# Altium schematic sheet Kinen Expansion.SchDoc
size B
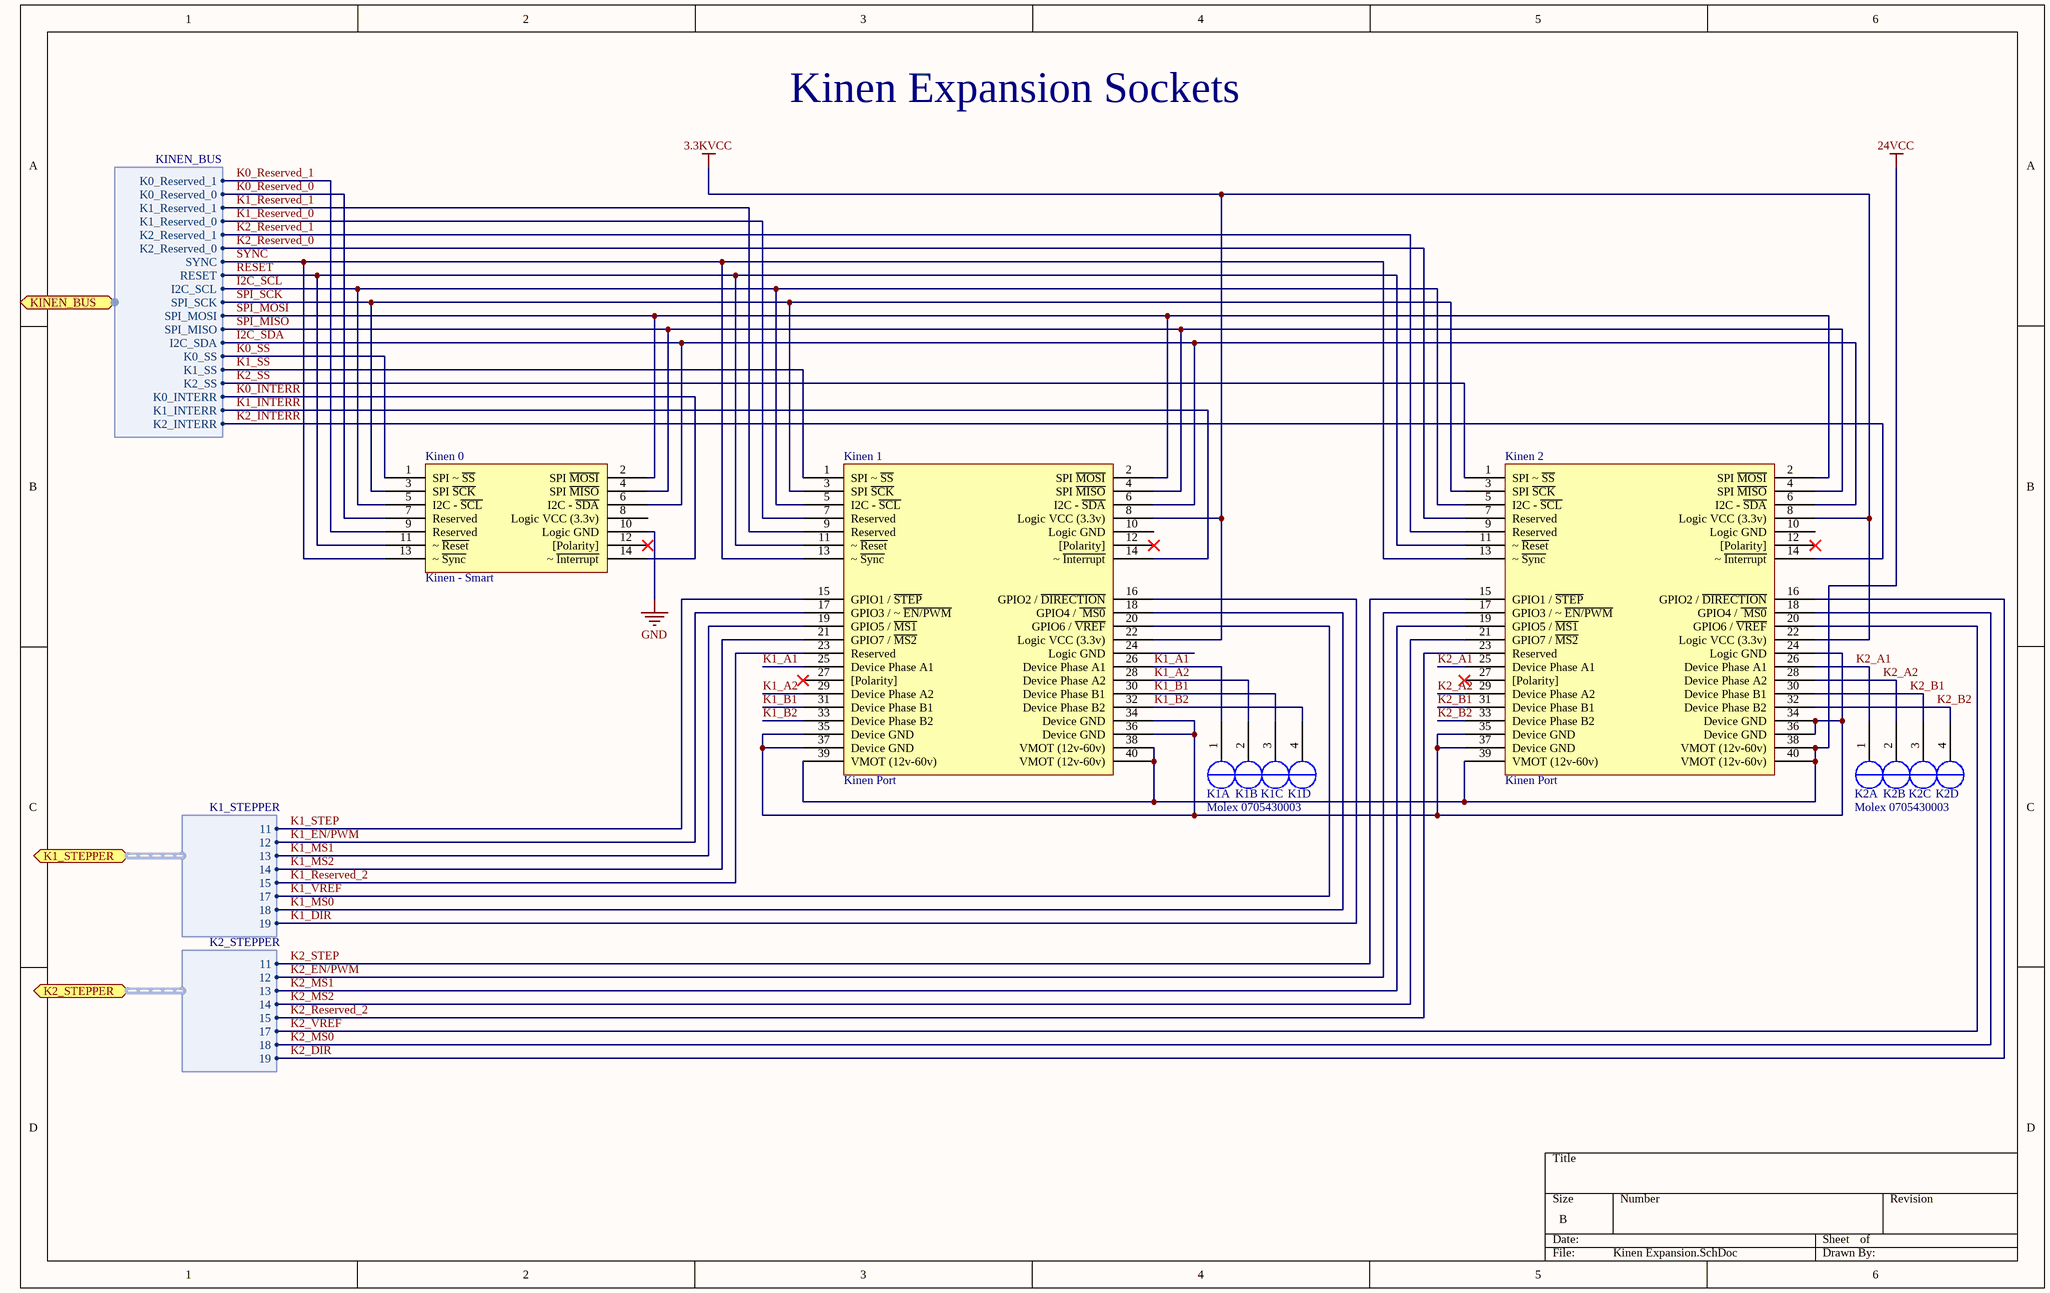
[diagram p0: Kinen Expansion.SchDoc]

## Parts
K1  Molex 0705430003  [Molex 0705430003]  (parts A,B,C,D of 4)
K2  Molex 0705430003  [Molex 0705430003]  (parts A,B,C,D of 4)
Kinen_0  Kinen - Smart  [Kinen Port - Smart - MOBO]
Kinen_1  Kinen Port  [Kinen Port - MOBO]
Kinen_2  Kinen Port  [Kinen Port - MOBO]

## Ports
K1_STEPPER (harness K1_STEPPER), K2_STEPPER (harness K2_STEPPER), KINEN_BUS (harness KINEN_BUS)

## Harnesses
K1_STEPPER: 11, 12, 13, 14, 15, 17, 18, 19
K2_STEPPER: 11, 12, 13, 14, 15, 17, 18, 19
KINEN_BUS: K0_Reserved_1, K0_Reserved_0, K1_Reserved_1, K1_Reserved_0, K2_Reserved_0, K2_Reserved_1, SYNC, RESET, I2C_SCL, SPI_SCK, SPI_MOSI, SPI_MISO, I2C_SDA, K0_SS, K2_SS, K1_SS, K0_INTERR, K1_INTERR, K2_INTERR

## Nets
3.3KVCC: Kinen_1.8(Logic_VCC_(3.3v)) Kinen_1.22(Logic_VCC_(3.3v)) Kinen_2.8(Logic_VCC_(3.3v)) Kinen_2.22(Logic_VCC_(3.3v))
24VCC: Kinen_1.38(VMOT_(12v-60v)) Kinen_1.39(VMOT_(12v-60v)) Kinen_1.40(VMOT_(12v-60v)) Kinen_2.38(VMOT_(12v-60v)) Kinen_2.39(VMOT_(12v-60v)) Kinen_2.40(VMOT_(12v-60v))
GND: Kinen_0.10(Logic_GND)
I2C_SCL: Kinen_0.5(I2C_-_~{SCL}) Kinen_1.5(I2C_-_~{SCL}) Kinen_2.5(I2C_-_~{SCL}) ; port KINEN_BUS.I2C_SCL
I2C_SDA: Kinen_0.6(I2C_-_~{SDA}) Kinen_1.6(I2C_-_~{SDA}) Kinen_2.6(I2C_-_~{SDA}) ; port KINEN_BUS.I2C_SDA
K0_INTERR: Kinen_0.14(~_~{Interrupt}) ; port KINEN_BUS.K0_INTERR
K0_Reserved_0: Kinen_0.7(Reserved) ; port KINEN_BUS.K0_Reserved_0
K0_Reserved_1: Kinen_0.9(Reserved) ; port KINEN_BUS.K0_Reserved_1
K0_SS: Kinen_0.1(SPI_~_~{SS}) ; port KINEN_BUS.K0_SS
K1_A1: K1.1(OUT2B) Kinen_1.25(Device_Phase_A1) Kinen_1.26(Device_Phase_A1)
K1_A2: K1.2(OUT2A) Kinen_1.28(Device_Phase_A2) Kinen_1.29(Device_Phase_A2)
K1_B1: K1.3(OUT1A) Kinen_1.30(Device_Phase_B1) Kinen_1.31(Device_Phase_B1)
K1_B2: K1.4(OUT1B) Kinen_1.32(Device_Phase_B2) Kinen_1.33(Device_Phase_B2)
K1_DIR: Kinen_1.16(GPIO2_/_~{DIRECTION}) ; port K1_STEPPER.19
K1_EN/PWM: Kinen_1.17(GPIO3_/_~_~{EN/PWM}) ; port K1_STEPPER.12
K1_INTERR: Kinen_1.14(~_~{Interrupt}) ; port KINEN_BUS.K1_INTERR
K1_MS0: Kinen_1.18(GPIO4_/_~{_MS0}) ; port K1_STEPPER.18
K1_MS1: Kinen_1.19(GPIO5_/_~{MS1}) ; port K1_STEPPER.13
K1_MS2: Kinen_1.21(GPIO7_/_~{MS2}) ; port K1_STEPPER.14
K1_Reserved_0: Kinen_1.7(Reserved) ; port KINEN_BUS.K1_Reserved_0
K1_Reserved_1: Kinen_1.9(Reserved) ; port KINEN_BUS.K1_Reserved_1
K1_Reserved_2: Kinen_1.23(Reserved) ; port K1_STEPPER.15
K1_SS: Kinen_1.1(SPI_~_~{SS}) ; port KINEN_BUS.K1_SS
K1_STEP: Kinen_1.15(GPIO1_/_~{STEP}) ; port K1_STEPPER.11
K1_VREF: Kinen_1.20(GPIO6_/_~{VREF}) ; port K1_STEPPER.17
K2_A1: K2.1(OUT2B) Kinen_2.25(Device_Phase_A1) Kinen_2.26(Device_Phase_A1)
K2_A2: K2.2(OUT2A) Kinen_2.28(Device_Phase_A2) Kinen_2.29(Device_Phase_A2)
K2_B1: K2.3(OUT1A) Kinen_2.30(Device_Phase_B1) Kinen_2.31(Device_Phase_B1)
K2_B2: K2.4(OUT1B) Kinen_2.32(Device_Phase_B2) Kinen_2.33(Device_Phase_B2)
K2_DIR: Kinen_2.16(GPIO2_/_~{DIRECTION}) ; port K2_STEPPER.19
K2_EN/PWM: Kinen_2.17(GPIO3_/_~_~{EN/PWM}) ; port K2_STEPPER.12
K2_INTERR: Kinen_2.14(~_~{Interrupt}) ; port KINEN_BUS.K2_INTERR
K2_MS0: Kinen_2.18(GPIO4_/_~{_MS0}) ; port K2_STEPPER.18
K2_MS1: Kinen_2.19(GPIO5_/_~{MS1}) ; port K2_STEPPER.13
K2_MS2: Kinen_2.21(GPIO7_/_~{MS2}) ; port K2_STEPPER.14
K2_Reserved_0: Kinen_2.7(Reserved) ; port KINEN_BUS.K2_Reserved_0
K2_Reserved_1: Kinen_2.9(Reserved) ; port KINEN_BUS.K2_Reserved_1
K2_Reserved_2: Kinen_2.23(Reserved) ; port K2_STEPPER.15
K2_SS: Kinen_2.1(SPI_~_~{SS}) ; port KINEN_BUS.K2_SS
K2_STEP: Kinen_2.15(GPIO1_/_~{STEP}) ; port K2_STEPPER.11
K2_VREF: Kinen_2.20(GPIO6_/_~{VREF}) ; port K2_STEPPER.17
RESET: Kinen_0.11(~_~{Reset}) Kinen_1.11(~_~{Reset}) Kinen_2.11(~_~{Reset}) ; port KINEN_BUS.RESET
SPI_MISO: Kinen_0.4(SPI_~{MISO}) Kinen_1.4(SPI_~{MISO}) Kinen_2.4(SPI_~{MISO}) ; port KINEN_BUS.SPI_MISO
SPI_MOSI: Kinen_0.2(SPI_~{MOSI}) Kinen_1.2(SPI_~{MOSI}) Kinen_2.2(SPI_~{MOSI}) ; port KINEN_BUS.SPI_MOSI
SPI_SCK: Kinen_0.3(SPI_~{SCK}) Kinen_1.3(SPI_~{SCK}) Kinen_2.3(SPI_~{SCK}) ; port KINEN_BUS.SPI_SCK
SYNC: Kinen_0.13(~_~{Sync}) Kinen_1.13(~_~{Sync}) Kinen_2.13(~_~{Sync}) ; port KINEN_BUS.SYNC
NetKinen_1_34: Kinen_1.34(Device_GND) Kinen_1.35(Device_GND) Kinen_1.36(Device_GND) Kinen_1.37(Device_GND) Kinen_2.24(Logic_GND) Kinen_2.34(Device_GND) Kinen_2.35(Device_GND) Kinen_2.36(Device_GND) Kinen_2.37(Device_GND)

Not connected (* = marked no-connect by the designer): Kinen_0 8(Logic_VCC_(3.3v)) 12([Polarity])*; Kinen_1 10(Logic_GND) 12([Polarity])* 24(Logic_GND) 27([Polarity])*; Kinen_2 10(Logic_GND) 12([Polarity])* 27([Polarity])*

## Notes on the sheet
- Kinen Expansion Sockets

## Library data of the parts
K1 K2 = Molex 0705430003 Alt: Molex 4 Pin Clip Connector
Kinen_1 Kinen_2 = Kinen Device NEW